# Altium schematic sheet ATMEL328P.SchDoc
size A3
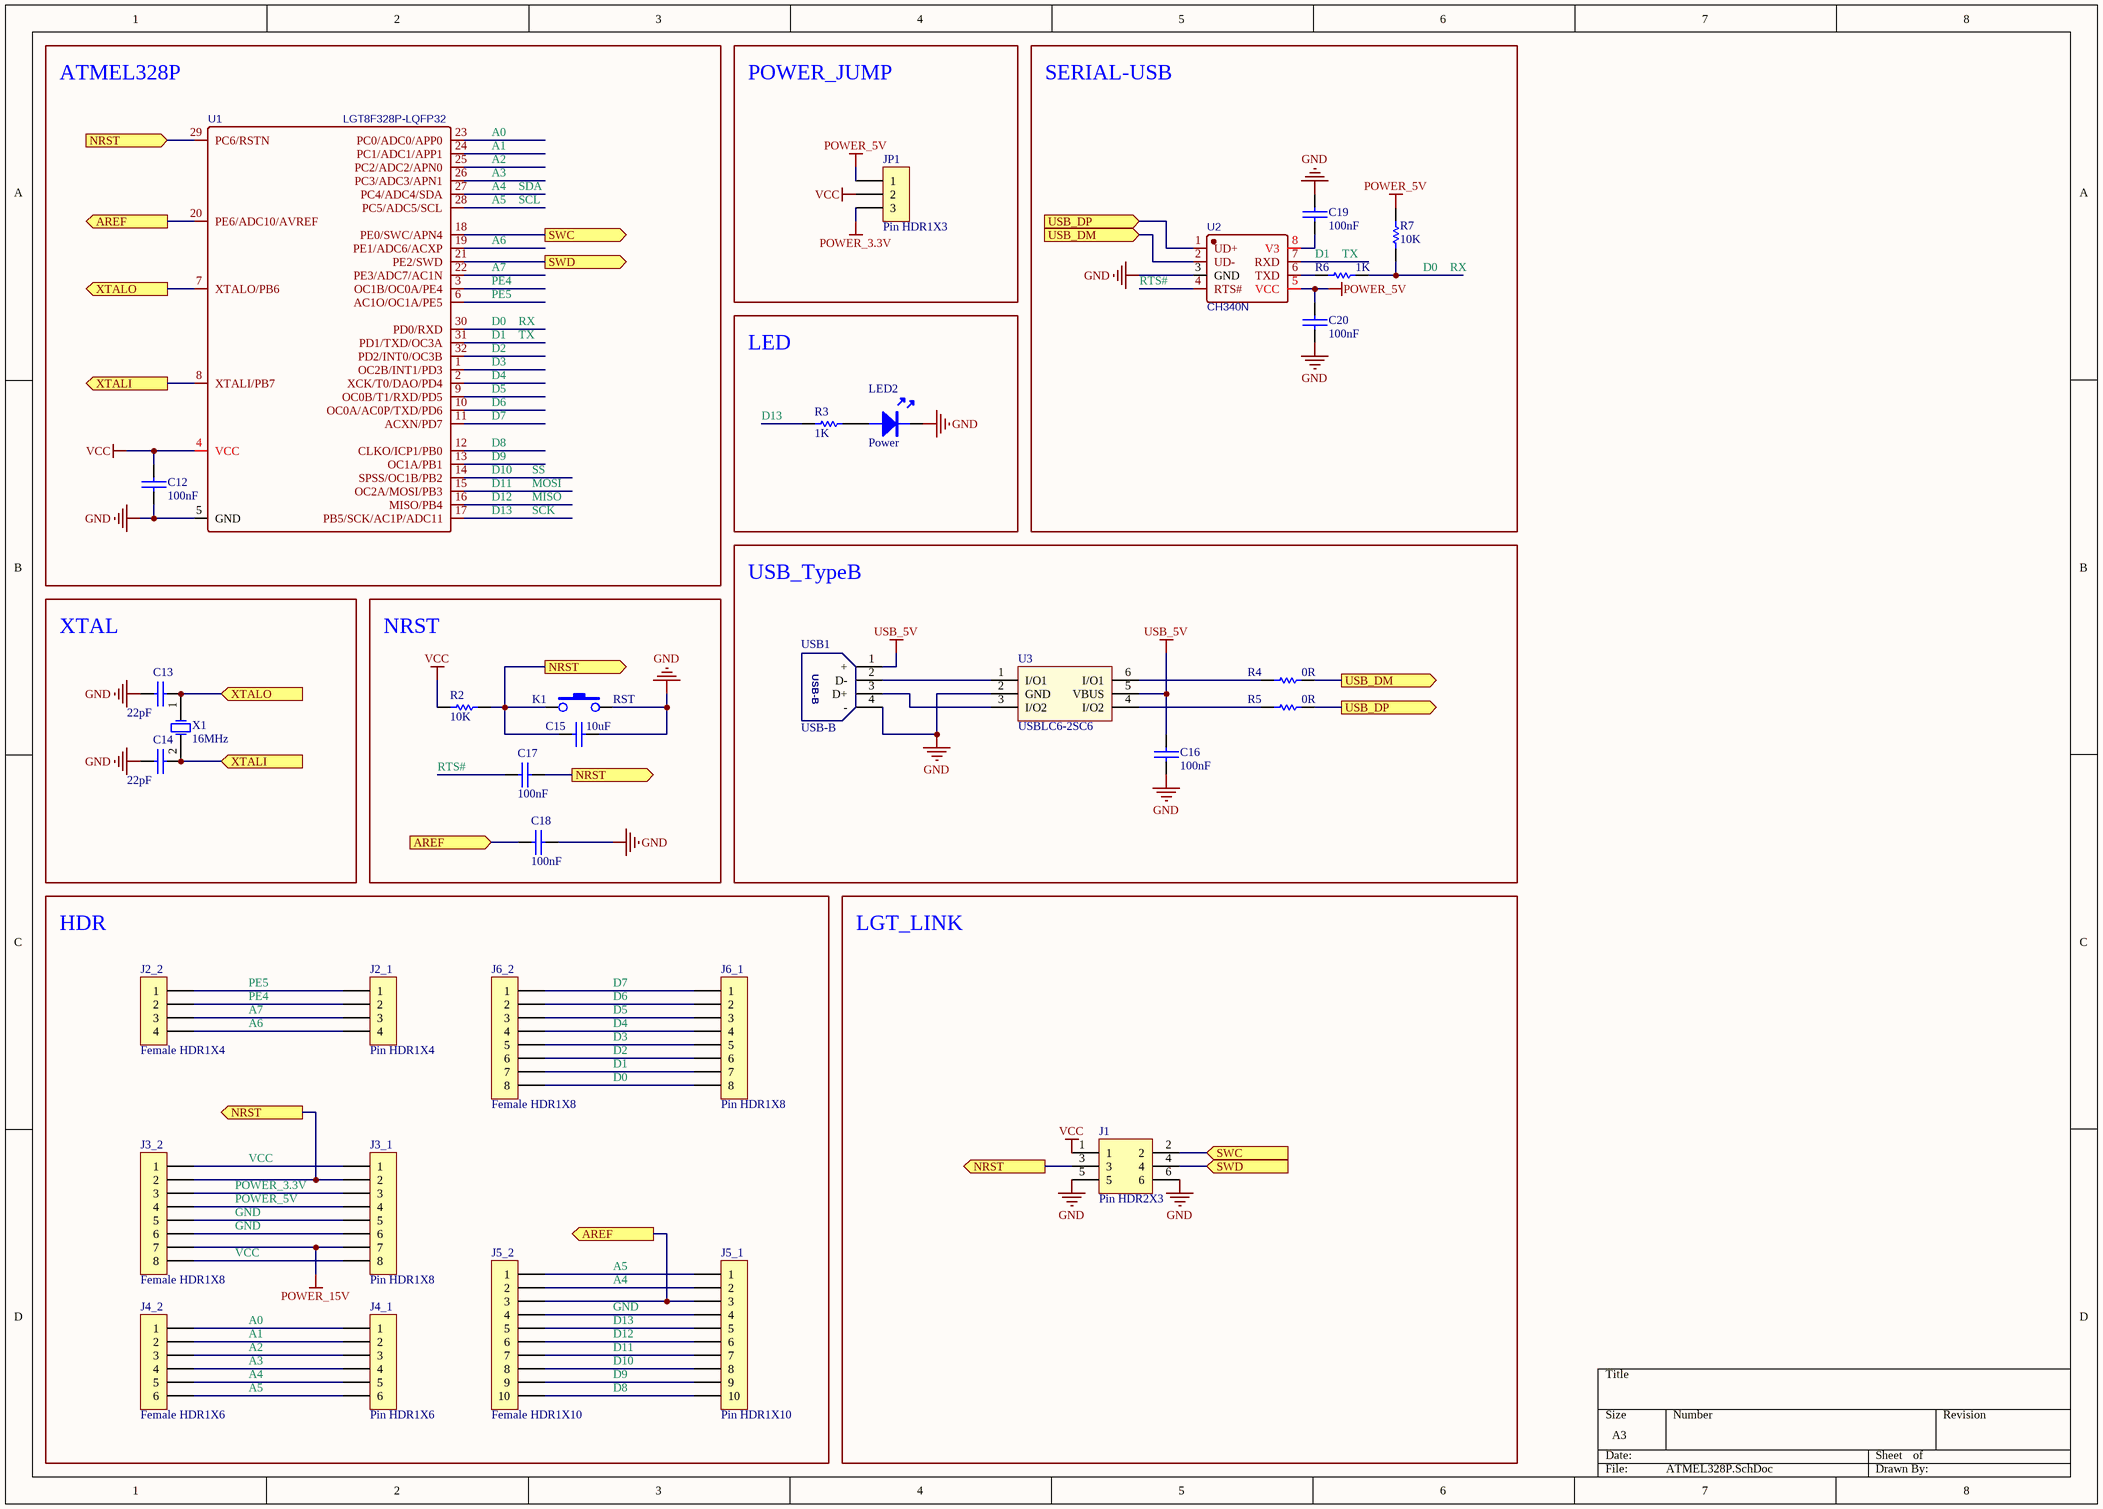
[diagram p0: ATMEL328P.SchDoc]

## Parts
C12  100nF  [0603C]
C13  22pF  [0603C]
C14  22pF  [0603C]
C15  10uF  [0603C]
C16  100nF  [0603C]
C17  100nF  [0603C]
C18  100nF  [0603C]
C19  100nF  [0603C]
C20  100nF  [0603C]
J1  Pin HDR2X3  [Pin HDR2X3/2.54mm-S]
J2_1  Pin HDR1X4  [Pin HDR1X4/2.54mm-S]
J2_2  Female HDR1X4  [Fe-HDR1X4/2.54-S]
J3_1  Pin HDR1X8  [Pin HDR1X8/2.54mm-S]
J3_2  Female HDR1X8  [Fe-HDR1X8/2.54-S]
J4_1  Pin HDR1X6  [Pin HDR1X6/2.54mm-S]
J4_2  Female HDR1X6  [Fe-HDR1X6/2.54-S]
J5_1  Pin HDR1X10  [Pin HDR1X10/2.54mm-S]
J5_2  Female HDR1X10  [Fe-HDR1X10/2.54-S]
J6_1  Pin HDR1X8  [Pin HDR1X8/2.54mm-S]
J6_2  Female HDR1X8  [Fe-HDR1X8/2.54-S]
JP1  Pin HDR1X3  [Pin HDR1X3/2.54mm-S]
K1  RST  [SMD-3X6X2.5]
LED2  Power  [LED-0805G]
R2  10K  [0603R]
R3  1K  [0603R]
R4  0R  [0603R]
R5  0R  [0603R]
R6  1K  [0603R]
R7  10K  [0603R]
U1  LGT8F328P-LQFP32  [LQFP32]
U2  CH340N  [SOP8]
U3  USBLC6-2SC6  [SOT23-6]
USB1  USB-B  [USB-B/S_A]
X1  16MHz  [OSC HC-49S]

## Blocks framed on the sheet
ATMEL328P: C12 U1
POWER_JUMP: JP1
SERIAL-USB: C19 C20 R6 R7 U2
LED: LED2 R3
USB_TypeB: C16 R4 R5 U3 USB1
XTAL: C13 C14 X1
NRST: C15 C17 C18 K1 R2
HDR: J2_1 J2_2 J3_1 J3_2 J4_1 J4_2 J5_1 J5_2 J6_1 J6_2
LGT_LINK: J1

## Ports
AREF (in), AREF (out), NRST (in), NRST (out), SWC (in), SWC (out), SWD (in), SWD (out), USB_DM (in), USB_DM (out), USB_DP (in), USB_DP (out), XTALI (in), XTALI (out), XTALO (in), XTALO (out)

## Nets
GND: C12.1 C13.1 C14.1 C15.2 C16.1 C18.2 C19.2 C20.2 J1.5 J1.6 J3_1.5 J3_1.6 J3_2.5 J3_2.6 J5_1.4 J5_2.4 K1.3 LED2.K U1.5(GND) U2.3(GND) U3.2(GND) USB1.4(-)
POWER_3.3V: J3_1.3 J3_2.3 JP1.3
POWER_5V: C20.1 J3_1.4 J3_2.4 JP1.1 R7.2 U2.5(VCC)
POWER_15V: J3_1.7 J3_2.7
USB_5V: C16.2 U3.5(VBUS) USB1.1(+)
VCC: C12.2 J1.1 J3_1.1 J3_1.8 J3_2.1 J3_2.8 JP1.2 R2.1 U1.4(VCC)
A0: J4_1.1 J4_2.1 U1.23(PC0/ADC0/APP0)
A1: J4_1.2 J4_2.2 U1.24(PC1/ADC1/APP1)
A2: J4_1.3 J4_2.3 U1.25(PC2/ADC2/APN0)
A3: J4_1.4 J4_2.4 U1.26(PC3/ADC3/APN1)
A4: J4_1.5 J4_2.5 J5_1.2 J5_2.2 U1.27(PC4/ADC4/SDA)  [also labelled SDA]
A5: J4_1.6 J4_2.6 J5_1.1 J5_2.1 U1.28(PC5/ADC5/SCL)  [also labelled SCL]
A6: J2_1.4 J2_2.4 U1.19(PE1/ADC6/ACXP)
A7: J2_1.3 J2_2.3 U1.22(PE3/ADC7/AC1N)
AREF: C18.1 J5_1.3 J5_2.3 U1.20(PE6/ADC10/AVREF) ; port AREF
D0: J6_1.8 J6_2.8 R6.1 R7.1 U1.30(PD0/RXD)  [also labelled RX]
D1: J6_1.7 J6_2.7 U1.31(PD1/TXD/OC3A) U2.7(RXD)  [also labelled TX]
D2: J6_1.6 J6_2.6 U1.32(PD2/INT0/OC3B)
D3: J6_1.5 J6_2.5 U1.1(OC2B/INT1/PD3)
D4: J6_1.4 J6_2.4 U1.2(XCK/T0/DAO/PD4)
D5: J6_1.3 J6_2.3 U1.9(OC0B/T1/RXD/PD5)
D6: J6_1.2 J6_2.2 U1.10(OC0A/AC0P/TXD/PD6)
D7: J6_1.1 J6_2.1 U1.11(ACXN/PD7)
D8: J5_1.10 J5_2.10 U1.12(CLKO/ICP1/PB0)
D9: J5_1.9 J5_2.9 U1.13(OC1A/PB1)
D10: J5_1.8 J5_2.8 U1.14(SPSS/OC1B/PB2)  [also labelled SS]
D11: J5_1.7 J5_2.7 U1.15(OC2A/MOSI/PB3)  [also labelled MOSI]
D12: J5_1.6 J5_2.6 U1.16(MISO/PB4)  [also labelled MISO]
D13: J5_1.5 J5_2.5 R3.2 U1.17(PB5/SCK/AC1P/ADC11)  [also labelled SCK]
NRST: C15.1 C17.2 J1.3 J3_1.2 J3_2.2 K1.1 R2.2 U1.29(PC6/RSTN) ; port NRST
PE4: J2_1.2 J2_2.2 U1.3(OC1B/OC0A/PE4)
PE5: J2_1.1 J2_2.1 U1.6(AC1O/OC1A/PE5)
RTS#: C17.1 U2.4(RTS#)
SWC: J1.2 U1.18(PE0/SWC/APN4) ; port SWC
SWD: J1.4 U1.21(PE2/SWD) ; port SWD
USB_DM: R4.2 U2.2(UD-) ; port USB_DM
USB_DP: R5.2 U2.1(UD+) ; port USB_DP
XTALI: C14.2 U1.8(XTALI/PB7) X1.2(OSC2) ; port XTALI
XTALO: C13.2 U1.7(XTALO/PB6) X1.1(OSC1) ; port XTALO
NetC19_1: C19.1 U2.8(V3)
NetLED2_A: LED2.A R3.1
NetR4_1: R4.1 U3.6(I/O1)
NetR5_1: R5.1 U3.4(I/O2)
NetR6_2: R6.2 U2.6(TXD)
NetU3_1: U3.1(I/O1) USB1.2(D-)
NetU3_3: U3.3(I/O2) USB1.3(D+)

## Library data of the parts
C12 C15-C20 = CAP: 无极性电容
C13 C14 = C
K1 = KEY
LED2 = LED
R2-R7 = RES
U1 = LGT8F328P-LQFP32: Contributor: 梦之精灵影像设计协会; spicePre: U; spiceSymbolName: LGT8F328P-LQFP32
U2 = CH340N: BOM_Manufacturer: WCH; Contributor: 梦之精灵影像设计协会; BOM_Supplier: LCSC; BOM_Supplier Part: C506813; BOM_Manufacturer Part: CH340N; spicePre: U; spiceSymbolName: CH340N
X1 = XTAL: Crystal Oscillator; Published: 8-Jun-2000; LatestRevisionDate: 17-Jul-2002; LatestRevisionNote: Re-released for DXP Platform.; PackageReference: R38; Publisher: Altium Limited